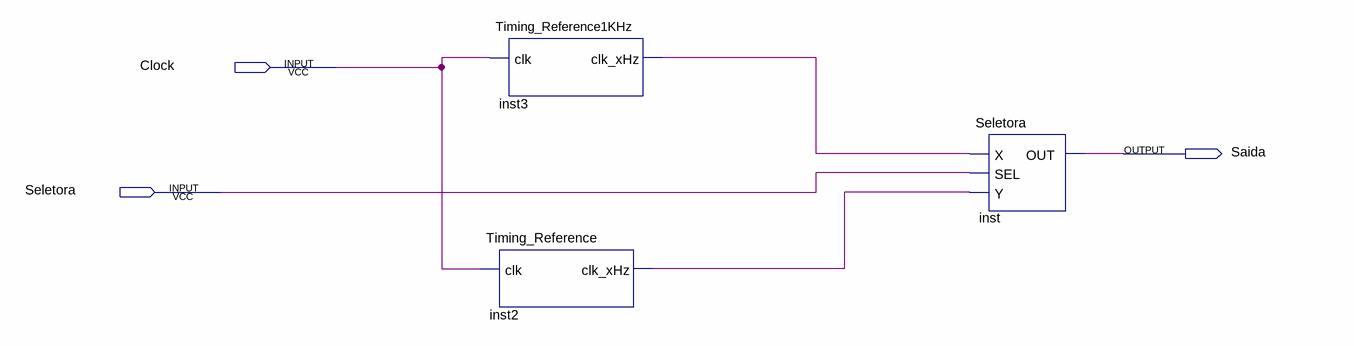
[diagram p0: schematic sheet]
// Quartus schematic Frequencia.bdf as structural Verilog: 3 symbols, 3 pins
module Frequencia (
  input  Clock,
  input  Seletora,
  output Saida
);

  wire inst2_clk_xhz, inst3_clk_xhz;

  Timing_Reference1KHz inst3 (.clk(Clock), .clk_xHz(inst3_clk_xhz));
  Timing_Reference inst2 (.clk(Clock), .clk_xHz(inst2_clk_xhz));
  Seletora inst (.X(inst3_clk_xhz), .SEL(Seletora), .Y(inst2_clk_xhz), .OUT(Saida));
endmodule
